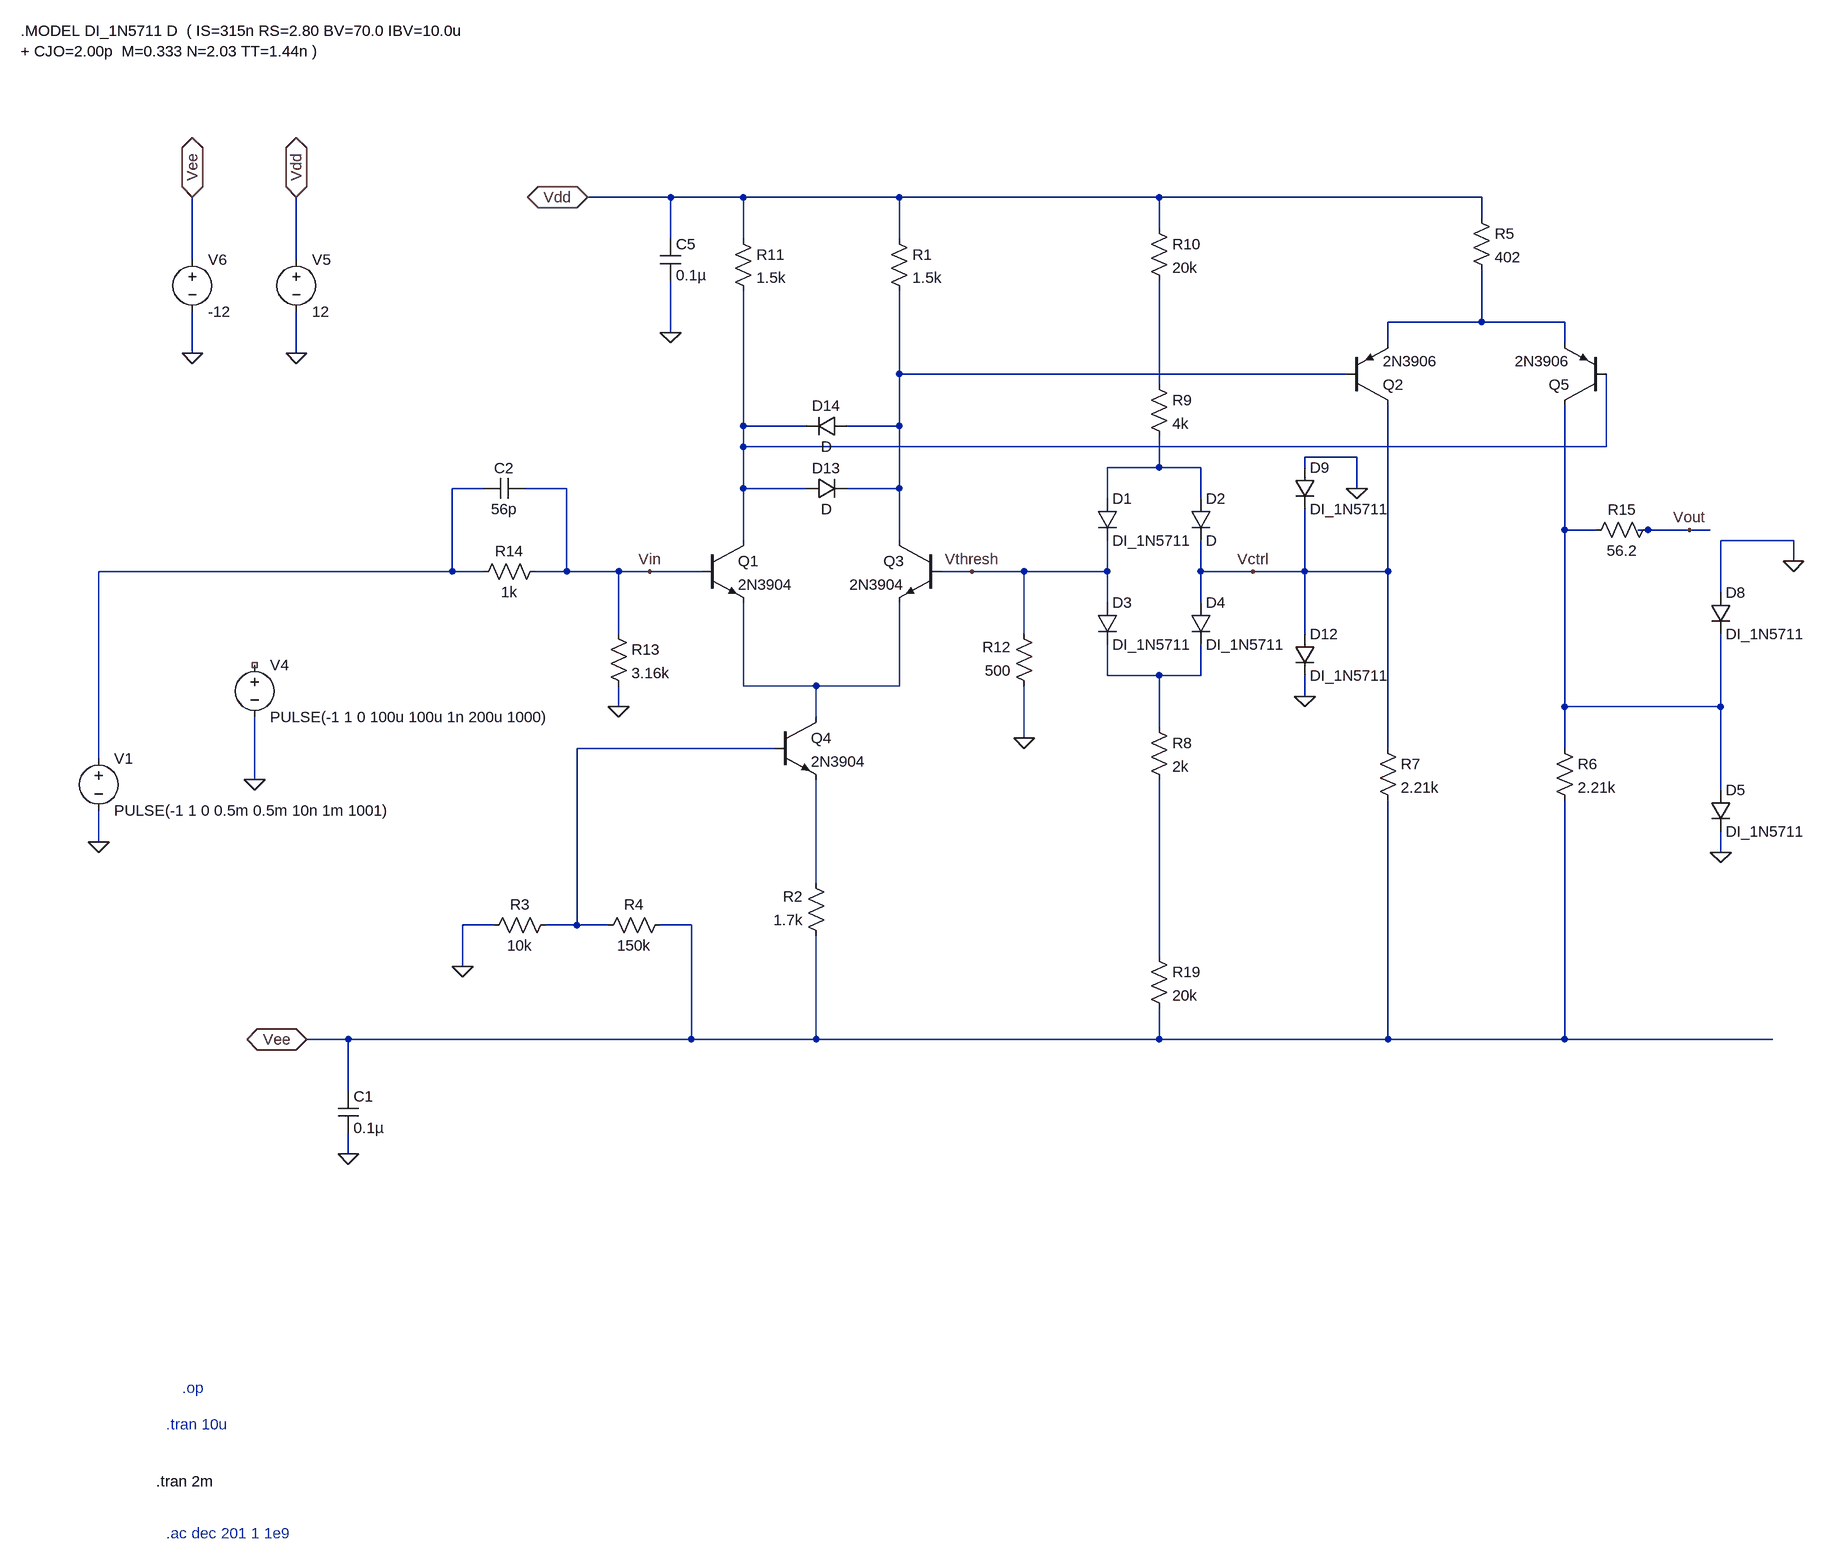
[diagram p0: schematic schmitt_trigger.asc]
schmitt_trigger.asc, the LTspice schematic file:
Version 4
SHEET 1 1504 2424
WIRE -272 352 -400 352
WIRE -160 352 -272 352
WIRE 80 352 -160 352
WIRE 480 352 80 352
WIRE 976 352 480 352
WIRE 976 384 976 352
WIRE 480 400 480 352
WIRE -272 416 -272 352
WIRE -160 416 -160 352
WIRE 80 416 80 352
WIRE -1008 448 -1008 352
WIRE -848 448 -848 352
WIRE 976 544 976 464
WIRE 976 544 832 544
WIRE 1104 544 976 544
WIRE -272 560 -272 480
WIRE 832 576 832 544
WIRE 1104 576 1104 544
WIRE -1008 592 -1008 528
WIRE -848 592 -848 528
WIRE 80 624 80 496
WIRE 768 624 80 624
WIRE 480 640 480 480
WIRE -160 704 -160 496
WIRE -64 704 -160 704
WIRE 80 704 80 624
WIRE 80 704 0 704
WIRE -160 736 -160 704
WIRE 1168 736 1168 624
WIRE 1168 736 -160 736
WIRE 784 752 704 752
WIRE 480 768 480 720
WIRE 480 768 400 768
WIRE 544 768 480 768
WIRE 704 768 704 752
WIRE -560 800 -608 800
WIRE -432 800 -496 800
WIRE -160 800 -160 736
WIRE -64 800 -160 800
WIRE 80 800 80 704
WIRE 80 800 0 800
WIRE 784 800 784 752
WIRE 400 816 400 768
WIRE 544 816 544 768
WIRE 1104 864 1104 672
WIRE 1152 864 1104 864
WIRE 1232 864 1216 864
WIRE 1296 864 1232 864
WIRE 1328 864 1296 864
WIRE -160 880 -160 800
WIRE 80 880 80 800
WIRE 1456 880 1344 880
WIRE 1456 912 1456 880
WIRE -608 928 -608 800
WIRE -608 928 -1152 928
WIRE -560 928 -608 928
WIRE -432 928 -432 800
WIRE -432 928 -480 928
WIRE -352 928 -432 928
WIRE -304 928 -352 928
WIRE -224 928 -304 928
WIRE 192 928 144 928
WIRE 272 928 192 928
WIRE 400 928 400 880
WIRE 400 928 272 928
WIRE 544 928 544 880
WIRE 624 928 544 928
WIRE 704 928 704 832
WIRE 704 928 624 928
WIRE 832 928 832 672
WIRE 832 928 704 928
WIRE 1344 960 1344 880
WIRE 400 976 400 928
WIRE 544 976 544 928
WIRE -352 1024 -352 928
WIRE 272 1024 272 928
WIRE 704 1024 704 928
WIRE 400 1088 400 1040
WIRE 480 1088 400 1088
WIRE 544 1088 544 1040
WIRE 544 1088 480 1088
WIRE -160 1104 -160 976
WIRE -48 1104 -160 1104
WIRE 80 1104 80 976
WIRE 80 1104 -48 1104
WIRE 704 1120 704 1088
WIRE -352 1136 -352 1104
WIRE 1104 1136 1104 864
WIRE 1344 1136 1344 1024
WIRE 1344 1136 1104 1136
WIRE -48 1152 -48 1104
WIRE 480 1168 480 1088
WIRE 272 1184 272 1104
WIRE -112 1200 -416 1200
WIRE 832 1200 832 928
WIRE 1104 1200 1104 1136
WIRE -1152 1216 -1152 928
WIRE -912 1248 -912 1152
WIRE 1344 1264 1344 1136
WIRE -1152 1344 -1152 1296
WIRE 1344 1360 1344 1328
WIRE -48 1408 -48 1248
WIRE -544 1472 -592 1472
WIRE -416 1472 -416 1200
WIRE -416 1472 -464 1472
WIRE -368 1472 -416 1472
WIRE -240 1472 -288 1472
WIRE 480 1520 480 1248
WIRE -592 1536 -592 1472
WIRE -768 1648 -832 1648
WIRE -240 1648 -240 1472
WIRE -240 1648 -768 1648
WIRE -48 1648 -48 1488
WIRE -48 1648 -240 1648
WIRE 480 1648 480 1600
WIRE 480 1648 -48 1648
WIRE 832 1648 832 1280
WIRE 832 1648 480 1648
WIRE 1104 1648 1104 1280
WIRE 1104 1648 832 1648
WIRE 1424 1648 1104 1648
WIRE -768 1728 -768 1648
WIRE -768 1824 -768 1792
FLAG -912 1248 0
FLAG 272 1184 0
FLAG 1296 864 Vout
FLAG -272 560 0
FLAG -848 592 0
FLAG -848 352 Vdd
IOPIN -848 352 BiDir
FLAG -1008 592 0
FLAG -1008 352 Vee
IOPIN -1008 352 BiDir
FLAG -832 1648 Vee
IOPIN -832 1648 BiDir
FLAG -592 1536 0
FLAG -400 352 Vdd
IOPIN -400 352 BiDir
FLAG 1344 1360 0
FLAG 1456 912 0
FLAG 784 800 0
FLAG 704 1120 0
FLAG -1152 1344 0
FLAG -768 1824 0
FLAG -352 1136 0
FLAG 624 928 Vctrl
FLAG 192 928 Vthresh
FLAG -304 928 Vin
DATAFLAG 112 352 "$"
DATAFLAG -272 1200 "$"
DATAFLAG -880 1024 "$"
DATAFLAG 304 928 "$"
DATAFLAG 272 624 "$"
DATAFLAG 880 544 "$"
DATAFLAG -48 1344 "$"
DATAFLAG -128 704 "$"
DATAFLAG 48 800 "$"
DATAFLAG 1216 816 "$"
DATAFLAG -384 928 "$"
DATAFLAG 1120 864 "$"
SYMBOL npn -224 880 R0
SYMATTR InstName Q1
SYMATTR Value 2N3904
SYMBOL npn 144 880 M0
SYMATTR InstName Q3
SYMATTR Value 2N3904
SYMBOL Res -176 400 R0
SYMATTR InstName R11
SYMATTR Value 1.5k
SYMBOL Res 288 1120 R180
WINDOW 0 36 76 Left 2
WINDOW 3 36 40 Left 2
SYMATTR InstName R12
SYMATTR Value 500
SYMBOL pnp 768 672 M180
SYMATTR InstName Q2
SYMATTR Value 2N3906
SYMBOL Voltage -912 1056 R0
SYMATTR InstName V4
SYMATTR Value PULSE(-1 1 0 100u 100u 1n 200u 1000)
SYMATTR SpiceLine Rser=50
SYMATTR Value2 AC 1
SYMBOL Res 464 1504 R0
SYMATTR InstName R19
SYMATTR Value 20k
SYMBOL Cap -288 416 R0
SYMATTR InstName C5
SYMATTR Value 0.1µ
SYMBOL Voltage -848 432 R0
SYMATTR InstName V5
SYMATTR Value 12
SYMBOL Voltage -1008 432 R0
SYMATTR InstName V6
SYMATTR Value -12
SYMBOL Res 64 400 R0
SYMATTR InstName R1
SYMATTR Value 1.5k
SYMBOL npn -112 1152 R0
SYMATTR InstName Q4
SYMATTR Value 2N3904
SYMBOL Res -32 1504 R180
WINDOW 0 36 76 Left 2
WINDOW 3 36 40 Left 2
SYMATTR InstName R2
SYMATTR Value 1.7k
SYMBOL Res -448 1456 R90
WINDOW 0 0 56 VBottom 2
WINDOW 3 32 56 VTop 2
SYMATTR InstName R3
SYMATTR Value 10k
SYMBOL Res -272 1456 R90
WINDOW 0 0 56 VBottom 2
WINDOW 3 32 56 VTop 2
SYMATTR InstName R4
SYMATTR Value 150k
SYMBOL pnp 1168 672 R180
SYMATTR InstName Q5
SYMATTR Value 2N3906
SYMBOL Res 960 368 R0
SYMATTR InstName R5
SYMATTR Value 402
SYMBOL Res 1088 1184 R0
SYMATTR InstName R6
SYMATTR Value 2.21k
SYMBOL Res 816 1184 R0
SYMATTR InstName R7
SYMATTR Value 2.21k
SYMBOL Res 464 1152 R0
SYMATTR InstName R8
SYMATTR Value 2k
SYMBOL Res 464 624 R0
SYMATTR InstName R9
SYMATTR Value 4k
SYMBOL Res 464 384 R0
SYMATTR InstName R10
SYMATTR Value 20k
SYMBOL Voltage -1152 1200 R0
SYMATTR InstName V1
SYMATTR Value PULSE(-1 1 0 0.5m 0.5m 10n 1m 1001)
SYMATTR SpiceLine Rser=50
SYMATTR Value2 AC 1
SYMBOL Diode -64 816 R270
WINDOW 0 32 32 VTop 2
WINDOW 3 0 32 VBottom 2
SYMATTR InstName D13
SYMBOL Diode 0 688 R90
WINDOW 0 0 32 VBottom 2
WINDOW 3 32 32 VTop 2
SYMATTR InstName D14
SYMBOL Diode 384 816 R0
SYMATTR InstName D1
SYMATTR Value DI_1N5711
SYMBOL Diode 384 976 R0
SYMATTR InstName D3
SYMATTR Value DI_1N5711
SYMBOL Diode 528 816 R0
SYMATTR InstName D2
SYMBOL Diode 528 976 R0
SYMATTR InstName D4
SYMATTR Value DI_1N5711
SYMBOL Diode 688 768 R0
SYMATTR InstName D9
SYMATTR Value DI_1N5711
SYMBOL Diode 688 1024 R0
SYMATTR InstName D12
SYMATTR Value DI_1N5711
SYMBOL Cap -784 1728 R0
SYMATTR InstName C1
SYMATTR Value 0.1µ
SYMBOL Res -464 912 R90
WINDOW 0 0 56 VBottom 2
WINDOW 3 32 56 VTop 2
SYMATTR InstName R14
SYMATTR Value 1k
SYMBOL Cap -496 784 R90
WINDOW 0 0 32 VBottom 2
WINDOW 3 32 32 VTop 2
SYMATTR InstName C2
SYMATTR Value 56p
SYMBOL diode 1328 1264 R0
SYMATTR InstName D5
SYMATTR Value DI_1N5711
SYMBOL diode 1328 960 R0
SYMATTR InstName D8
SYMATTR Value DI_1N5711
SYMBOL Res -368 1008 R0
SYMATTR InstName R13
SYMATTR Value 3.16k
SYMBOL Res 1248 848 R90
WINDOW 0 0 56 VBottom 2
WINDOW 3 32 56 VTop 2
SYMATTR InstName R15
SYMATTR Value 56.2
TEXT -1064 2328 Left 2 !.tran 2m
TEXT -1048 2408 Left 2 ;.ac dec 201 1 1e9
TEXT -1048 2240 Left 2 ;.tran 10u
TEXT -1024 2184 Left 2 ;.op
TEXT -1272 96 Left 2 !.MODEL DI_1N5711 D  ( IS=315n RS=2.80 BV=70.0 IBV=10.0u\n+ CJO=2.00p  M=0.333 N=2.03 TT=1.44n )

The netlist it stands for:
* schmitt_trigger.asc
Q1 N004 Vin N009 0 2N3904
Q3 N002 Vthresh N009 0 2N3904
R11 Vdd N004 1.5k
R12 0 Vthresh 500
Q2 Vctrl N002 N001 0 2N3906
V4 NC_01 0 PULSE(-1 1 0 100u 100u 1n 200u 1000) AC 1 Rser=50
R19 N012 Vee 20k
C5 Vdd 0 0.1µ
V5 Vdd 0 12
V6 Vee 0 -12
R1 Vdd N002 1.5k
Q4 N009 N010 N011 0 2N3904
R2 Vee N011 1.7k
R3 N010 0 10k
R4 Vee N010 150k
Q5 N007 N004 N001 0 2N3906
R5 Vdd N001 402
R6 N007 Vee 2.21k
R7 Vctrl Vee 2.21k
R8 N008 N012 2k
R9 N003 N005 4k
R10 Vdd N003 20k
V1 N006 0 PULSE(-1 1 0 0.5m 0.5m 10n 1m 1001) AC 1 Rser=50
D13 N004 N002 D
D14 N002 N004 D
D1 N005 Vthresh DI_1N5711
D3 Vthresh N008 DI_1N5711
D2 N005 Vctrl D
D4 Vctrl N008 DI_1N5711
D9 0 Vctrl DI_1N5711
D12 Vctrl 0 DI_1N5711
C1 Vee 0 0.1µ
R14 Vin N006 1k
C2 Vin N006 56p
D5 N007 0 DI_1N5711
D8 0 N007 DI_1N5711
R13 Vin 0 3.16k
R15 Vout N007 56.2
.model D D
.lib standard.dio
.model NPN NPN
.model PNP PNP
.lib standard.bjt
.tran 2m
* .ac dec 201 1 1e9
* .tran 10u
* .op
.MODEL DI_1N5711 D  ( IS=315n RS=2.80 BV=70.0 IBV=10.0u
+ CJO=2.00p  M=0.333 N=2.03 TT=1.44n )
.backanno
.end